# Altium schematic sheet drone_sch.SchDoc
size A4; SheetNumber: 1; SheetTotal: 1
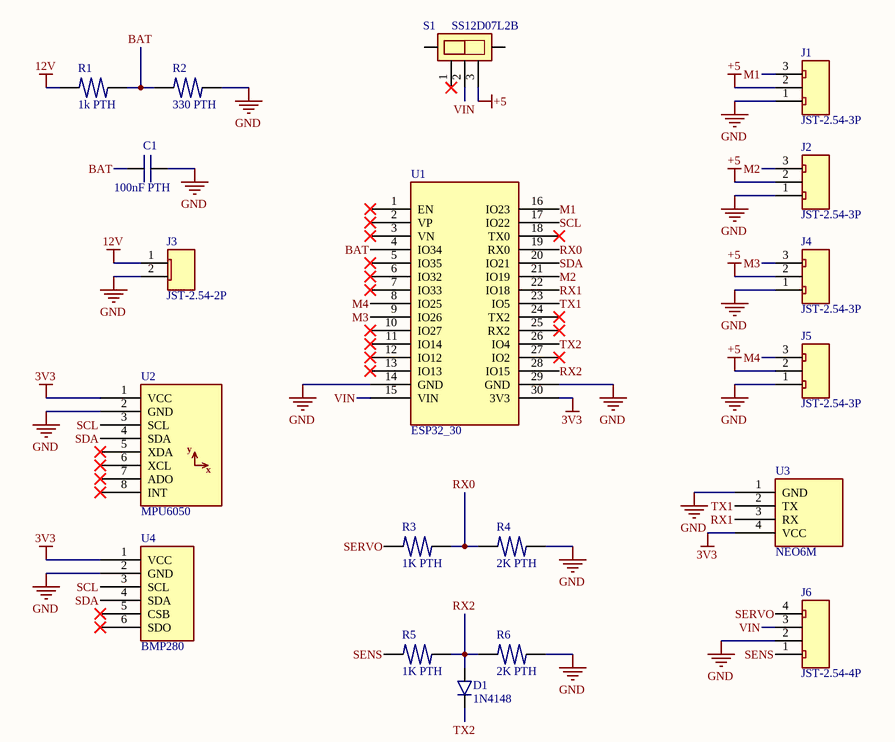
[diagram p0: drone_sch.SchDoc]

## Parts
C1  100nF PTH  [CAPACITOR 103]
D1  1N4148  [1N4148]
J1  JST-2.54-3P  [JST-2.54-3P]
J2  JST-2.54-3P  [JST-2.54-3P]
J3  JST-2.54-2P  [JST-2.54-2P]
J4  JST-2.54-3P  [JST-2.54-3P]
J5  JST-2.54-3P  [JST-2.54-3P]
J6  JST-2.54-4P  [JST-2.54-4P]
R1  1k PTH  [RESISTOR_PTH_9.5mm]
R2  330 PTH  [RESISTOR_PTH_9.5mm]
R3  1K PTH  [RESISTOR_PTH_9.5mm]
R4  2K PTH  [RESISTOR_PTH_9.5mm]
R5  1K PTH  [RESISTOR_PTH_9.5mm]
R6  2K PTH  [RESISTOR_PTH_9.5mm]
S1  SS12D07L2B  [SS12D07L2B]
U1  ESP32_30  [ESP32_30]
U2  MPU6050  [MPU6050]
U3  NEO6M  [NEO6M]
U4  BMP280  [BMP280]

## Nets
3V3: U1.30(3V3) U2.1(VCC) U3.4(VCC) U4.1(VCC)
12V: J3.1 R1.1
+5: J1.2 J2.2 J4.2 J5.2 S1.3
GND: C1.1 J1.1 J2.1 J3.2 J4.1 J5.1 J6.2 R2.2 R4.2 R6.2 U1.14(GND) U1.29(GND) U2.2(GND) U3.1(GND) U4.2(GND)
BAT: C1.2 R1.2 R2.1 U1.4(IO34)
M1: J1.3 U1.16(IO23)
M2: J2.3 U1.21(IO19)
M3: J4.3 U1.9(IO26)
M4: J5.3 U1.8(IO25)
RX0: R3.2 R4.1 U1.19(RX0)
RX1: U1.22(IO18) U3.3(RX)
RX2: D1.1 R5.2 R6.1 U1.28(IO15)
SCL: U1.17(IO22) U2.3(SCL) U4.3(SCL)
SDA: U1.20(IO21) U2.4(SDA) U4.4(SDA)
SENS: J6.1 R5.1
SERVO: J6.4 R3.1
TX1: U1.23(IO5) U3.2(TX)
TX2: D1.2 U1.26(IO4)
VIN: J6.3 S1.2 U1.15(VIN)

Not connected (* = marked no-connect by the designer): S1 1*; U1 1(EN)* 2(VP)* 3(VN)* 5(IO35)* 6(IO32)* 7(IO33)* 10(IO27)* 11(IO14)* 12(IO12)* 13(IO13)* 18(TX0)* 24(TX2)* 25(RX2)* 27(IO2)*; U2 5(XDA)* 6(XCL)* 7(ADO)* 8(INT)*; U4 5(CSB)* 6(SDO)*

## Notes on the sheet
- (in symbol MPU6050) y; x

## Library data of the parts
C1 = CAPACITOR 103: Ceramic Capacitor 103, 5mm.
D1 = 1N4148: Diode Gen Purp 75V 300mA DO35; Digikey PN: 1655-1N4148CT-ND; Mouser PN: 637-1N5399; JLCPCB PN: C14516
J1 J2 J4 J5 = JST-2.54-3P: Female Connector JST 3 Vias, 2.54mm.
J3 = JST-2.54-2P: Female Connector JST 2 Vias, 2.54mm.
J6 = JST-2.54-4P: Female Connector JST 4 Vias, 2.54mm.
R1-R6 = RESISTOR_9.5mm: Generic Resistor 9.5mm.
S1 = SS12D07L2B: Vertical Slide Switch 5 Pins 8.7x4.5x4.7mm.; JLCPCB PN: C480342
U1 = ESP32_30: Microcontoller Board 30 Pins Wifi 2.4GHz BLE 4.2 ESP32-WROOM-32D; ComponentLink1Description: Datasheet; ComponentLink1URL: https://www.mouser.com/datasheet/2/891/esp32_wroom_32d_esp32_wroom_32u_datasheet_en-1365844.pdf
U2 = MPU6050: IMU ACCEL/GYRO 3-AXIS I2C; ComponentLink1Description: Datasheet; ComponentLink1URL: https://invensense.tdk.com/wp-content/uploads/2015/02/MPU-6000-Datasheet1.pdf
U4 = BMP280: SENSOR ATMOSPHERIC PRESSURE/TEMPERATURE/ALTITUDE